# EAGLE design MyFirstEagleProject (EAGLE 6.3)
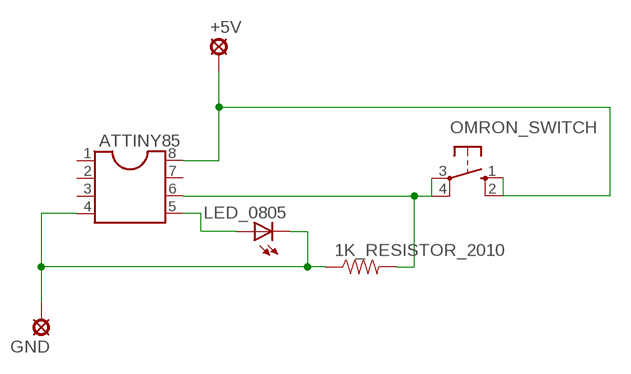
[diagram p0: schematic, sheet 1]

## Parts
1K_RESISTOR_2010  RESISTOR2010  [R2010]
+5V  SE14  [SE14]
ATTINY85  DIL8S  [SOCKET-08]
GND  SE14  [SE14]
LED_0805  LEDCHIPLED_0805  [CHIPLED_0805]
OMRON_SWITCH  10-XX  [B3F-10XX]

## Nets
5V: +5V.MP ATTINY85.8 OMRON_SWITCH.1(S) OMRON_SWITCH.2(S1)
GND: 1K_RESISTOR_2010.1 ATTINY85.4 GND.MP LED_0805.C
N$1: ATTINY85.5 LED_0805.A
N$6: 1K_RESISTOR_2010.2 ATTINY85.6 OMRON_SWITCH.3(P) OMRON_SWITCH.4(P1)
Unconnected: ATTINY85.1 ATTINY85.2 ATTINY85.3 ATTINY85.7

## Library data of the parts
1K_RESISTOR_2010 = SparkFun:RESISTOR: Resistor Basic schematic elements and footprints for 0603, 1206, and PTH resistors.
+5V GND = solpad:SE14: SOLDER PAD E1553, drill 1,4mm, distributor Buerklin, 07F820
ATTINY85 = ic-package:DIL8: Dual In Line / Socket
LED_0805 = led:LED: LED OSRAM: - CHIPLED LG R971, LG N971, LY N971, LG Q971, LY Q971, LO R971, LY R971 LH N974, LH R974 LS Q976, LO Q976, LY Q976 LO Q996 - Hyper CHIPLED LW Q18S LB Q993, LB Q99A, LB R99A - SideLED LS A670, LO A670, LY A670, LG A670, LP A670 LB A673, LV A673, LT A673, LW A673 LH A674 LY A675 LS A676, LA A676, LO A676, LY A676, LW A676 LS A679, LY A679, LG A679 - Hyper Micro SIDELED® LS Y876, LA Y876, LO Y876, LY Y876 LT Y87S - SmartLED LW L88C, LW L88S LB L89C, LB L89S, LG L890 LS L89K, LO L89K, LY L89K LS L896, LA L896, LO L896, LY L896 - TOPLED LS T670, LO T670, LY T670, LG T670, LP T670 LSG T670, LSP T670, LSY T670, LOP T670, LYG T670 LG T671, LOG T671, LSG T671 LB T673, LV T673, LT T673, LW T673 LH T674 LS T676, LA T676, LO T676, LY T676, LB T676, LH T676, LSB T676, LW T676 LB T67C, LV T67C, LT T67C, LS T67K, LO T67K, LY T67K, LW E67C LS E67B, LA E67B, LO E67B, LY E67B, LB E67C, LV E67C, LT E67C LW T67C LS T679, LY T679, LG T679 LS T770, LO T770, LY T770, LG T770, LP T770 LB T773, LV T773, LT T773, LW T773 LH T774 LS E675, LA E675, LY E675, LS T675 LS T776, LA T776, LO T776, LY T776, LB T776 LHGB T686 LT T68C, LB T68C - Hyper Mini TOPLED® LB M676 - Mini TOPLED Santana® LG M470 LS M47K, LO M47K, LY M47K Source: http://www.osram.convergy.de LUXEON: - LUMILED® LXK2-PW12-R00, LXK2-PW12-S00, LXK2-PW14-U00, LXK2-PW14-V00 LXK2-PM12-R00, LXK2-PM12-S00, LXK2-PM14-U00 LXK2-PE12-Q00, LXK2-PE12-R00, LXK2-PE12-S00, LXK2-PE14-T00, LXK2-PE14-U00 LXK2-PB12-K00, LXK2-PB12-L00, LXK2-PB12-M00, LXK2-PB14-N00, LXK2-PB14-P00, LXK2-PB14-Q00 LXK2-PR12-L00, LXK2-PR12-M00, LXK2-PR14-Q00, LXK2-PR14-R00 LXK2-PD12-Q00, LXK2-PD12-R00, LXK2-PD12-S00 LXK2-PH12-R00, LXK2-PH12-S00 LXK2-PL12-P00, LXK2-PL12-Q00, LXK2-PL12-R00 Source: www.luxeon.com KINGBRIGHT: KA-3528ASYC Source: www.kingbright.com
OMRON_SWITCH = switch-omron:10-XX: OMRON SWITCH; MPN: B3F-1000; OC_FARNELL: 176432; OC_NEWARK: 36M3542

## Board
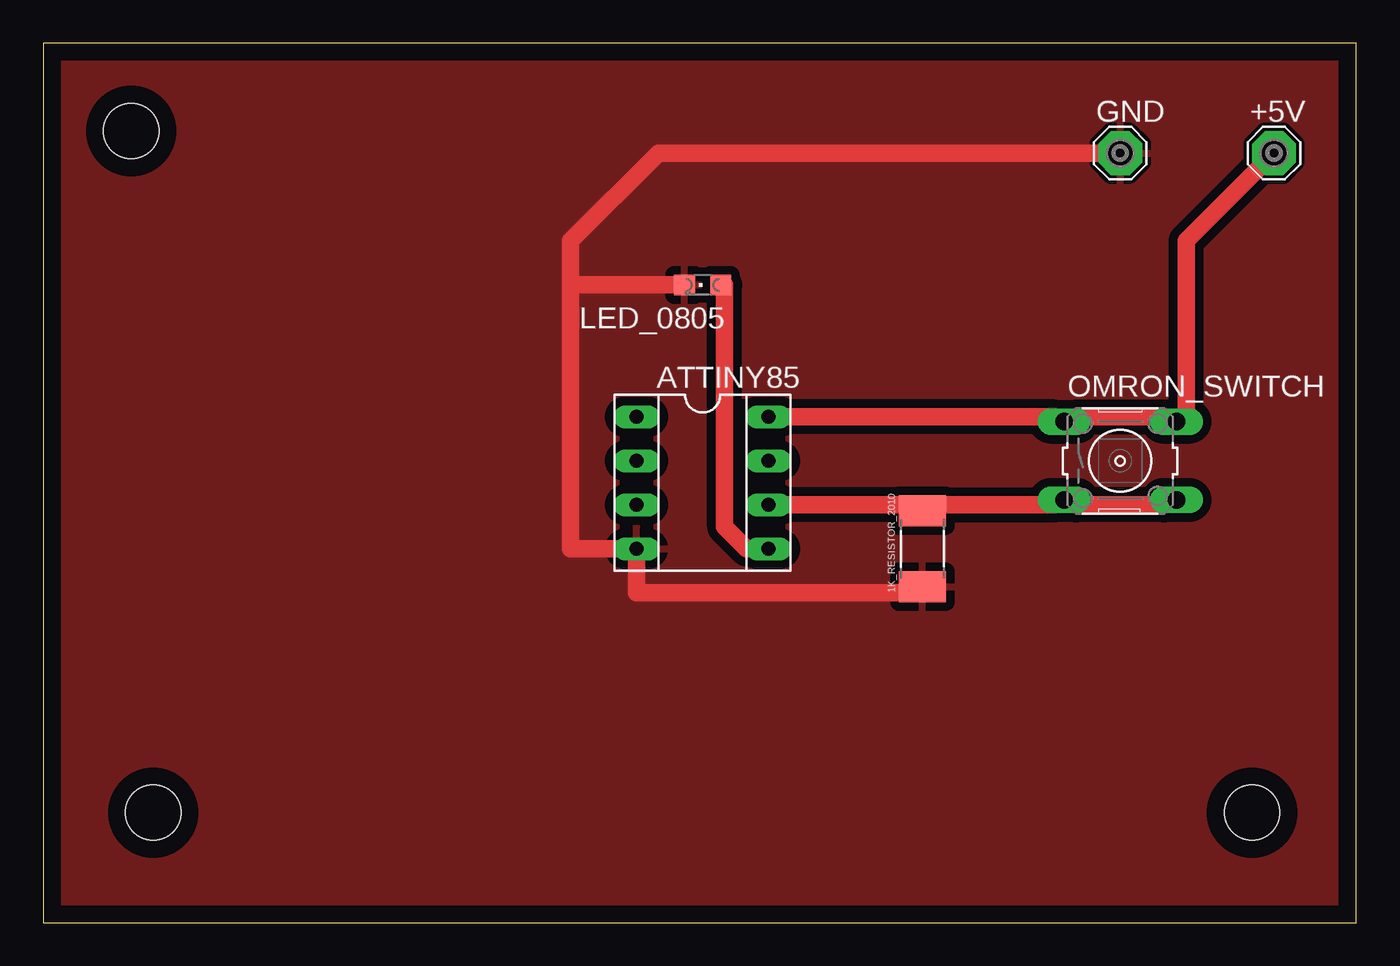
[diagram p1: board, top side]

Size 75.87 x 50.79 mm. Coordinates in mm from the lower left corner, seen from the top.
Outline: 0,0 75.87,0 75.87,50.79 0,50.79 0,0
Copper layers (1*16): Top 0.035mm / dielectric 1.5mm / Bottom 0.035mm
Design rules "BasicHandEtching": minimum track width 40mil, minimum drill 24mil, track to track 20mil, track to pad 20mil, pad to pad 20mil, via to via 20mil, smd to smd 20mil, copper to edge 40mil, drill to drill 8mil, minimum pad ring 10mil, minimum via ring 8mil, stop-mask expansion 4mil, vias tented up to drill 0mil, thermal gap 20mil
Holes 3.17 mm at 5.08,45.72 6.35,6.35 69.85,6.35

### Footprints (pad centres in the part's own frame; a part is rotated, then mirrored left to right if it is on the bottom)
R2010 = smd 1.8 x 2.7: 1 -2.2,0; 2 2.2,0
SE14 = drill 1.397 pad 2.54 octagon: MP 0,0
SOCKET-08 = drill 0.813 long: 1 -3.81,-3.81; 2 -1.27,-3.81; 3 1.27,-3.81; 4 3.81,-3.81; 5 3.81,3.81; 6 1.27,3.81; 7 -1.27,3.81; 8 -3.81,3.81
CHIPLED_0805 = smd 1.2 x 1.2: A 0,-1.05; C 0,1.05
B3F-10XX = drill 1.016 long: 1 -3.251,2.261; 2 3.251,2.261; 3 -3.251,-2.261; 4 3.251,-2.261

### Placement (x,y rotation side)
1K_RESISTOR_2010  50.8,21.59 90 top
+5V  71.12,44.45 0 top
ATTINY85  38.1,25.4 270 top
GND  62.23,44.45 0 top
LED_0805  38.1,36.83 90 top
OMRON_SWITCH  62.23,26.67 0 top

### Tracks (layer width: path | path; a pad name or v marks a point on that pad's centre or on a via)
5V
  Top 1.016: ATTINY85.8 58.42,29.21 OMRON_SWITCH.1 59.69,29.21 64.77,29.21 OMRON_SWITCH.2 66.04,29.21 66.04,39.37 +5V.MP
GND
  Top 1.016: 30.48,36.83 30.48,21.59 ATTINY85.4 34.29,19.05 50.8,19.05 1K_RESISTOR_2010.1 | GND.MP 35.56,44.45 30.48,39.37 30.48,36.83 | 30.48,36.83 LED_0805.C
  pour Top: 0,50.8 76.2,50.8 76.2,0 0,0
N$1
  Top 1.016: ATTINY85.5 40.64,21.59 39.37,22.86 39.37,36.83 LED_0805.A
N$6
  Top 1.016: OMRON_SWITCH.4 64.77,24.13 59.69,24.13 OMRON_SWITCH.3 58.42,24.13 52.07,24.13 | 52.07,24.13 50.8,24.13 | 50.8,24.13 ATTINY85.6 | 52.07,24.13 1K_RESISTOR_2010.2 50.8,24.13